# Altium schematic sheet pwr.SchDoc
size 209 x 297 mm; DocumentCode: Децимальный номер; SchemeType: Схема электрическая принципиальная; PageSetup: Record=PageOptionsZCenterHorizontal=TrueZCenterVertical=TrueZPrintScale=0.95ZXCorrection=1.00ZYCorrection=1.00ZPrintKind=2ZBorderSize=5000000ZLeftOffset=0ZBottomOffset=0ZOrientation=1ZPaperLength=1000ZPaperWidth=1000ZScale=100ZPaperSource=7ZPrintQuality=600ZMediaType=1ZDitherType=10ZPaperKind=A4 (210 x 297 мм)ZPrintScaleMode=1
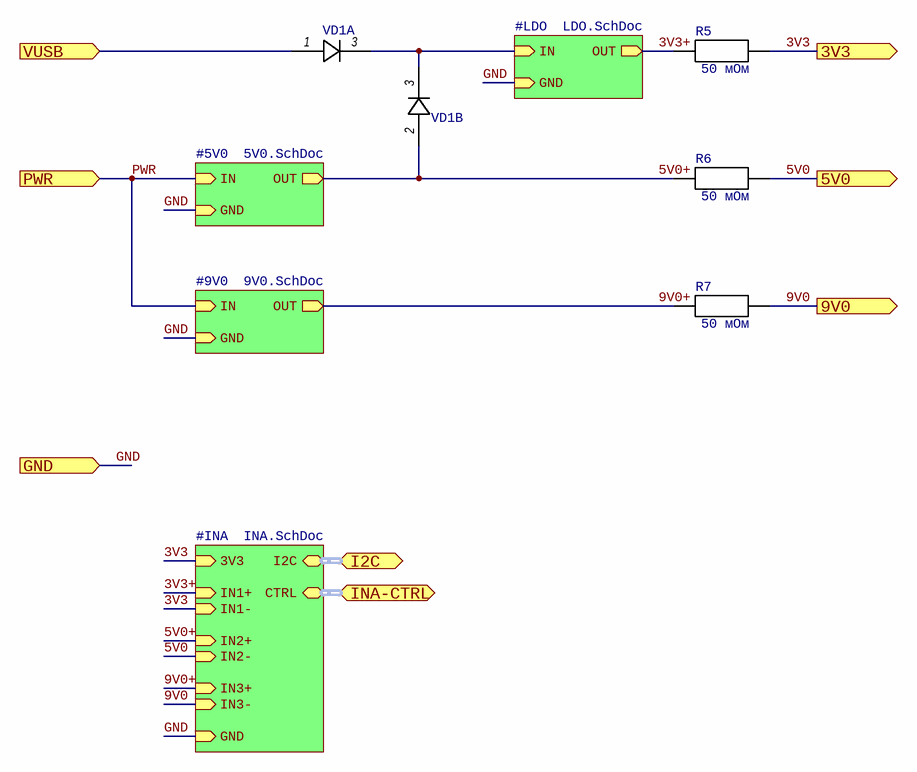
[diagram p0: pwr.SchDoc]

## Parts
R5  value 50 мОм  [STD-0805]  (hidden comment: res)
R6  value 50 мОм  [STD-0805]  (hidden comment: res)
R7  value 50 мОм  [STD-0805]  (hidden comment: res)
VD1  diode-2k  [SOT-23-3]  (value not drawn)  (parts A,B of 2)

## Sub-sheets
#5V0 = 5V0.SchDoc: GND (in), IN (in), OUT (out)
#9V0 = 9V0.SchDoc: GND (in), IN (in), OUT (out)
#INA = INA.SchDoc: GND (in), 3V3 (in), IN1+ (in), IN1- (in), IN2+ (in), IN2- (in), IN3+ (in), IN3- (in), I2C (harness I2C), CTRL (harness INA-CTRL)
#LDO = LDO.SchDoc: GND (in), IN (in), OUT (out)

## Ports
3V3 (out), 5V0 (out), 9V0 (out), GND (in), I2C (harness I2C), INA-CTRL (harness I2C), PWR (in), VUSB (in)

## Nets
3V3: R5.2 ; port 3V3, sheet #INA/3V3, sheet #INA/IN1-
3V3+: R5.1 ; sheet #LDO/OUT, sheet #INA/IN1+
5V0: R6.2 ; port 5V0, sheet #INA/IN2-
5V0+: R6.1 VD1.2 ; sheet #5V0/OUT, sheet #INA/IN2+
9V0: R7.2 ; port 9V0, sheet #INA/IN3-
9V0+: R7.1 ; sheet #9V0/OUT, sheet #INA/IN3+
GND: port GND, sheet #9V0/GND, sheet #5V0/GND, sheet #LDO/GND, sheet #INA/GND
PWR: port PWR, sheet #9V0/IN, sheet #5V0/IN
VUSB: VD1.1 ; port VUSB
NetVD1_3: VD1.3 ; sheet #LDO/IN

## Buses and harness runs
harness port I2C = sheet #INA/I2C
harness port INA-CTRL = sheet #INA/CTRL

## Notes on the sheet
- Перв. примен.
- Справ. №
- Подп. и дата
- Инв. № дубл.
- Взам. инв. №
- Изм.
- Лист
- № докум.
- Подп.
- Дата
- Инв. № подл.
- Копировал
- Формат А4

## Library data of the parts
R5-R7 = R0805-r05-1%-1/4W: Резистор; Part Number: R0805-r05-1%-1/4W
VD1 = PMEG2005CT.215: Диод сдвоенный; Part Number: PMEG2005CT.215